# EAGLE design pi backback (EAGLE 6.4)
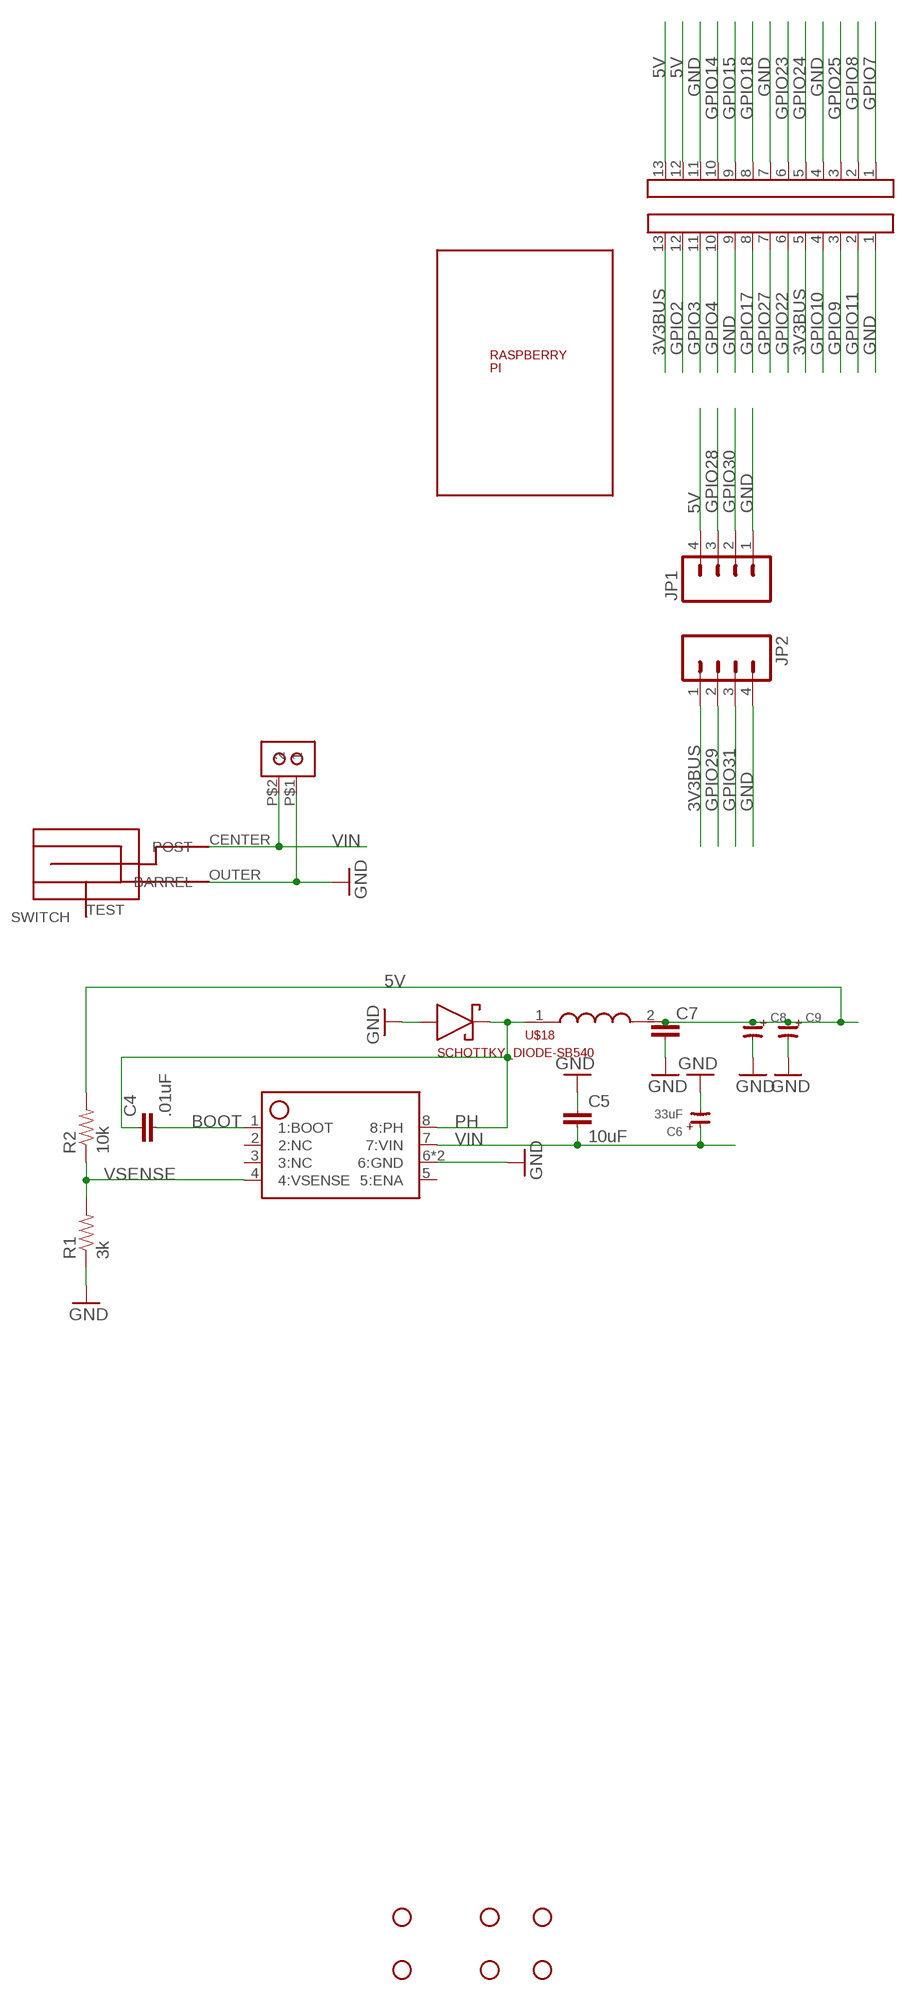
[diagram p0: schematic, sheet 1, part 1 of 2]
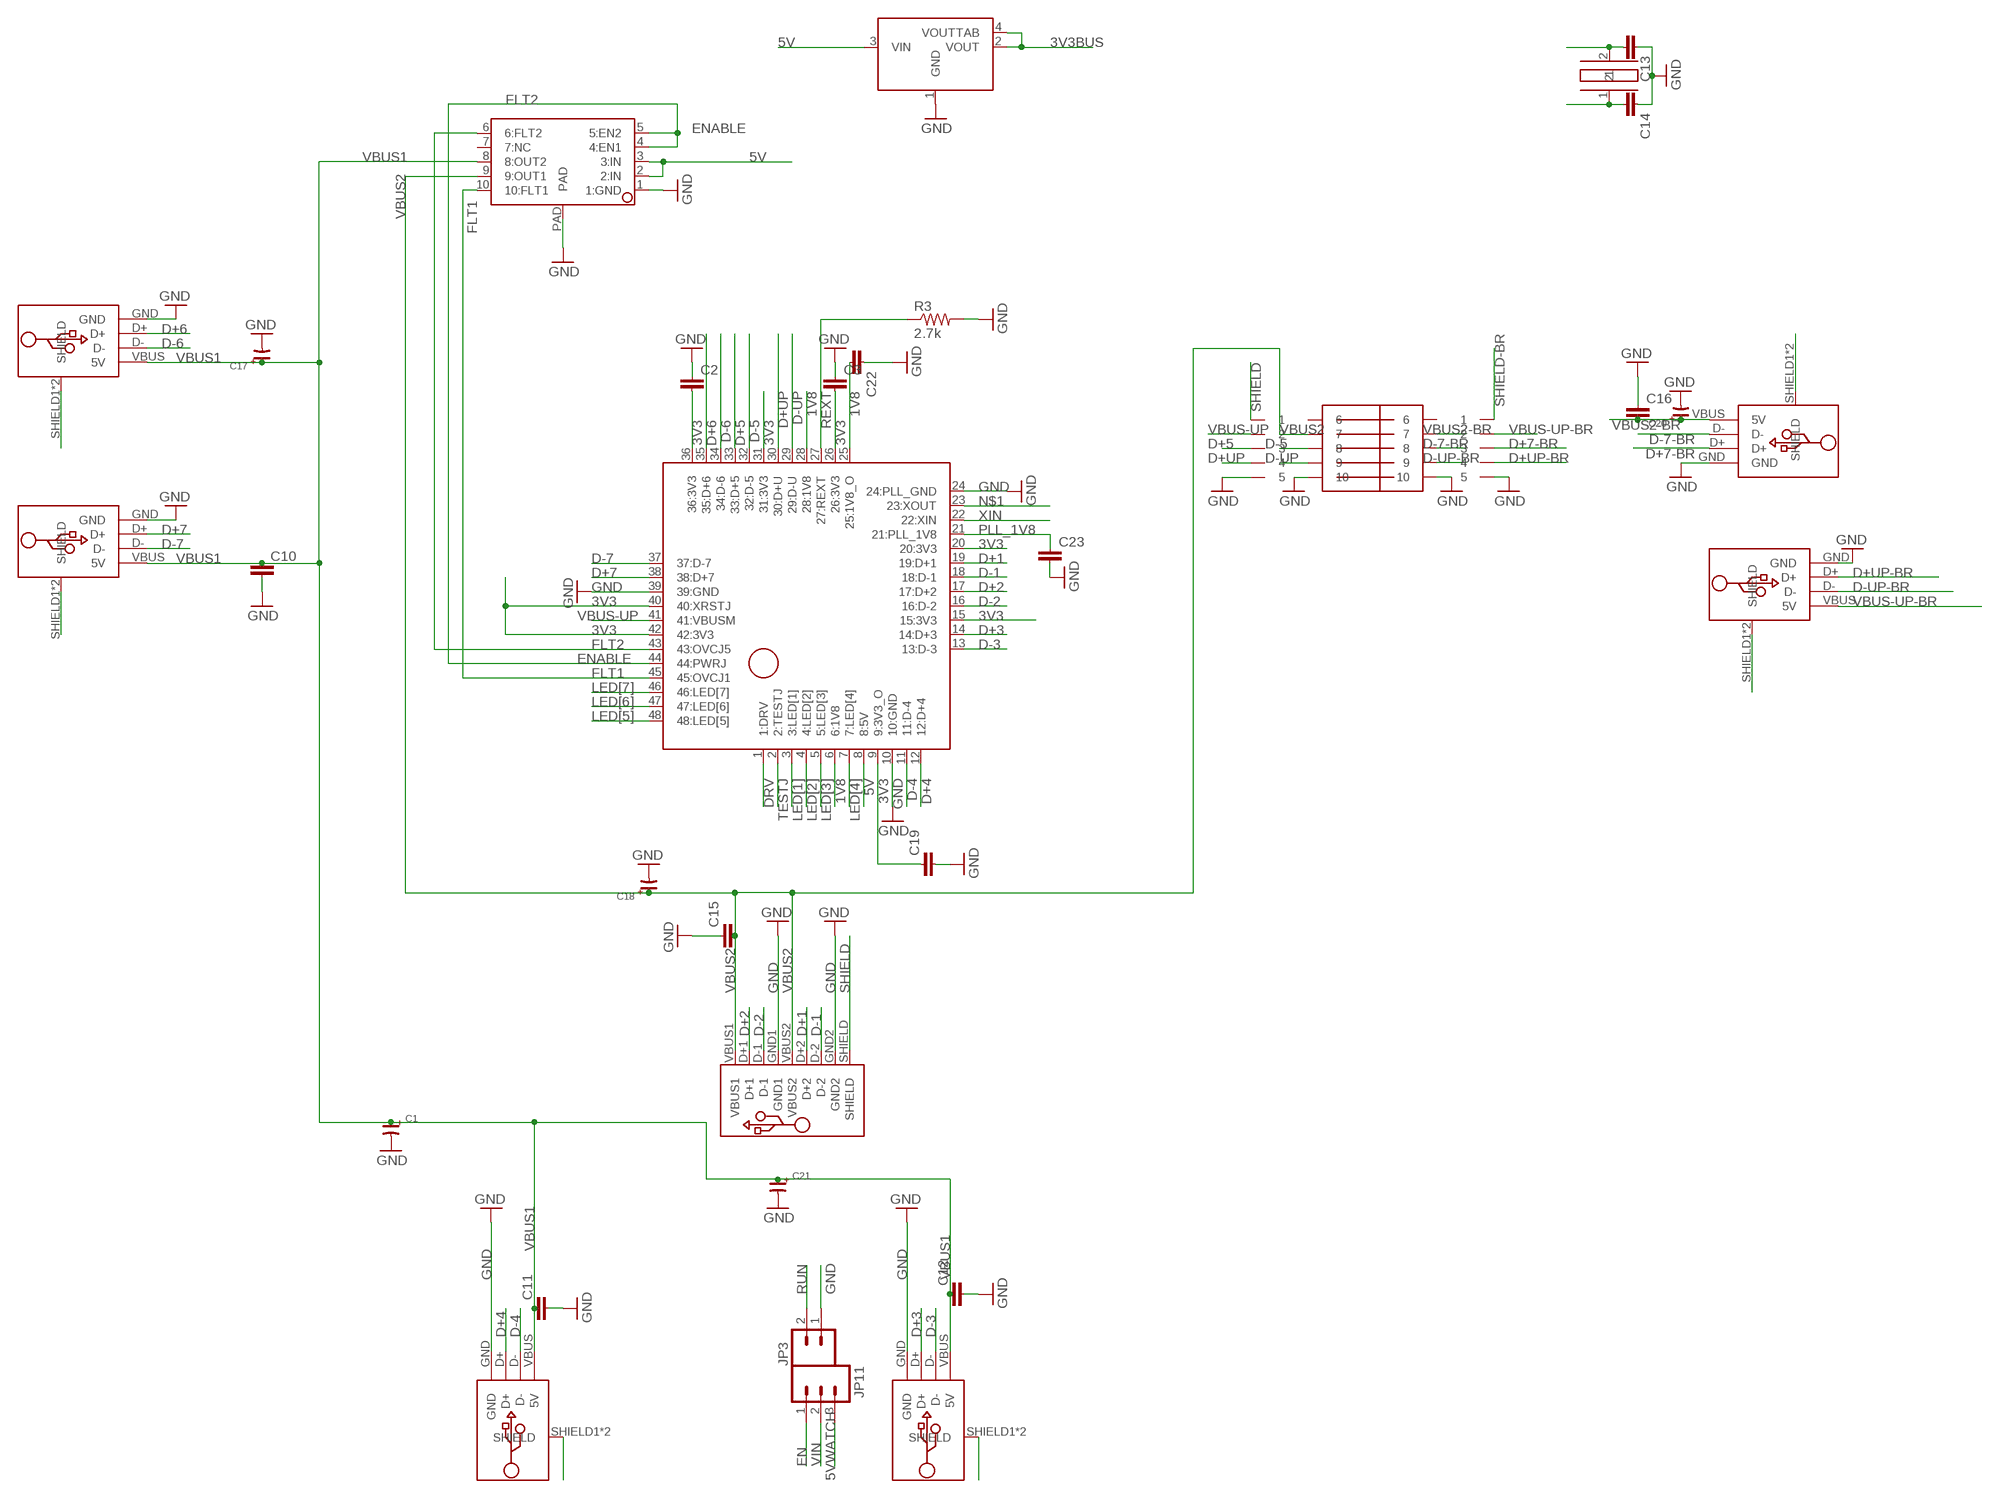
[diagram p1: schematic, sheet 1, part 2 of 2]

## Parts
C1  CAPPOL-5X11  [5X11MMCAP]
C2  CAP0805  [0805]
C3  CAP0805  [0805]
C4  .01uF  CAP0603-CAP  [0603-CAP]
C5  10uF  CAP1206  [1206]
C6  33uF  CAPPOL-8X11  [8MMCAP]
C7  CAP1206  [1206]
C8  CAPPOL-XX6.3  [6.3MMDIAMELECTROLYTIC]
C9  CAPPOL-XX6.3  [6.3MMDIAMELECTROLYTIC]
C10  CAP0805  [0805]
C11  CAP0805  [0805]
C12  CAP0805  [0805]
C13  CAP0603-CAP  [0603-CAP]
C14  CAP0603-CAP  [0603-CAP]
C15  CAP0805  [0805]
C16  CAP0805  [0805]
C17  CAPPOL-5X11  [5X11MMCAP]
C18  CAPPOL-5X11  [5X11MMCAP]
C19  CAP1206  [1206]
C20  CAPPOL-5X11  [5X11MMCAP]
C21  CAPPOL-5X11  [5X11MMCAP]
C22  CAP1206  [1206]
C23  CAP0805  [0805]
JP1  M04LOCK  [1X04_LOCK]
JP2  M04LOCK  [1X04_LOCK]
JP3  M02LOCK  [1X02_LOCK]
JP4  STAND-OFFTIGHT  [STAND-OFF-TIGHT]
JP5  STAND-OFFTIGHT  [STAND-OFF-TIGHT]
JP6  STAND-OFFTIGHT  [STAND-OFF-TIGHT]
JP7  STAND-OFFTIGHT  [STAND-OFF-TIGHT]
JP9  STAND-OFFTIGHT  [STAND-OFF-TIGHT]
JP10  STAND-OFFTIGHT  [STAND-OFF-TIGHT]
JP11  M03LOCK  [1X03_LOCK]
R1  3k  RESISTOR  [0805]
R2  10k  RESISTOR  [0805]
R3  2.7k  RESISTOR  [0805]
U$1  RASPBERRY-PI-OUTLINE  [RASPBERRY-PI-REV2-OUTLINE]
U$2  M13  [1X13_LOCK]
U$3  M13  [1X13_LOCK]
U$4  TPS200(2/3)C  [SON-10]
U$5  FE2.1-48  [LQFP-48]
U$6  USB-A-MALE  [USB-A-MALE]
U$7  SCREWTERM-2MA212-2  [MA212-2]
U$8  USB-A-FEMALE  [USB-A-FEMALE]
U$9  USB-A-FEMALE  [USB-A-FEMALE]
U$10  USB-A-FEMALE  [USB-A-FEMALE]
U$11  USB_HEADER  [USB_HEADER]
U$12  USB-A-FEMALE  [USB-A-FEMALE]
U$13  TPS5450  [SOIC8-POWERPAD]
U$14  M05X02_FEM-LOCK_RIGHT_ANGLE_FEM  [2X05_LOCK_RIGHT_ANGLE_FEM]
U$15  M05X02_MALE  [2X05_LOCK_RIGHT_ANGLE_MALE]
U$16  USB-A-FEMALE  [USB-A-FEMALE]
U$17  POWER-JACK-2.1MM  [2.1MM-POWER-JACK]
U$18  INDUCTOR-DR13-RT-A  [DR13-RT-A]
U$19  SCHOTTKY_DIODE-SB540  [DO-201-AD]
U$20  CRYSTAL-HC49  [HC49US]
U$21  3V3-LDO-ZLDO1117  [ZLDO1117]

## Nets
1V8: C22.2 U$5.6(6:1V8) U$5.25(25:1V8_O) U$5.28(28:1V8)
3V3: C2.2 C3.2 C19.1 U$5.9(9:3V3_O) U$5.15(15:3V3) U$5.20(20:3V3) U$5.26(26:3V3) U$5.31(31:3V3) U$5.36(36:3V3) U$5.40(40:XRSTJ) U$5.42(42:3V3)
3V3BUS: JP2.1 U$2.5 U$2.13 U$21.2(VOUT) U$21.4(VOUTTAB)
5V: C7.1 C8.+ C9.+ JP1.4 R2.2 U$3.12 U$3.13 U$4.2(2:IN) U$4.3(3:IN) U$5.8(8:5V) U$18.2 U$21.3(VIN)
5VWATCH: JP11.3
BOOT: C4.2 U$13.1(1:BOOT)
D+1: U$5.19(19:D+1) U$11.D+2
D+2: U$5.17(17:D+2) U$11.D+1
D+3: U$5.14(14:D+3) U$12.D+
D+4: U$5.12(12:D+4) U$16.D+
D+5: U$5.33(33:D+5) U$14.3
D+6: U$5.35(35:D+6) U$9.D+
D+7: U$5.38(38:D+7) U$8.D+
D+7-BR: U$10.D+ U$15.3
D+UP: U$5.30(30:D+U) U$14.4
D+UP-BR: U$6.D+ U$15.4
D-1: U$5.18(18:D-1) U$11.D-2
D-2: U$5.16(16:D-2) U$11.D-1
D-3: U$5.13(13:D-3) U$12.D-
D-4: U$5.11(11:D-4) U$16.D-
D-5: U$5.32(32:D-5) U$14.8
D-6: U$5.34(34:D-6) U$9.D-
D-7: U$5.37(37:D-7) U$8.D-
D-7-BR: U$10.D- U$15.8
D-UP: U$5.29(29:D-U) U$14.9
D-UP-BR: U$6.D- U$15.9
DRV: U$5.1(1:DRV)
EN: JP11.1
ENABLE: U$4.4(4:EN1) U$4.5(5:EN2) U$5.44(44:PWRJ)
FLT1: U$4.10(10:FLT1) U$5.45(45:OVCJ1)
FLT2: U$4.6(6:FLT2) U$5.43(43:OVCJ5)
GND: C1.- C2.1 C3.1 C5.1 C6.- C7.2 C8.- C9.- C10.2 C11.2 C12.2 C13.1 C14.1 C15.1 C16.1 C17.- C18.- C19.2 C20.- C21.- C22.1 C23.2 JP1.1 JP2.4 JP3.1 R1.1 R3.2 U$2.1 U$2.9 U$3.4 U$3.7 U$3.11 U$4.1(1:GND) U$4.PAD U$5.10(10:GND) U$5.24(24:PLL_GND) U$5.39(39:GND) U$6.GND U$7.P$1 U$8.GND U$9.GND U$10.GND U$11.GND1 U$11.GND2 U$12.GND U$13.6(6:GND) U$13.PAD(6:GND) U$14.5 U$14.10 U$15.5 U$15.10 U$16.GND U$17.OUTER(BARREL) U$19.A(ANODE) U$21.1(GND)
GPIO2: U$2.12
GPIO3: U$2.11
GPIO4: U$2.10
GPIO7: U$3.1
GPIO8: U$3.2
GPIO9: U$2.3
GPIO10: U$2.4
GPIO11: U$2.2
GPIO14: U$3.10
GPIO15: U$3.9
GPIO17: U$2.8
GPIO18: U$3.8
GPIO22: U$2.6
GPIO23: U$3.6
GPIO24: U$3.5
GPIO25: U$3.3
GPIO27: U$2.7
GPIO28: JP1.3
GPIO29: JP2.2
GPIO30: JP1.2
GPIO31: JP2.3
LED[1]: U$5.3(3:LED[1])
LED[2]: U$5.4(4:LED[2])
LED[3]: U$5.5(5:LED[3])
LED[4]: U$5.7(7:LED[4])
LED[5]: U$5.48(48:LED[5])
LED[6]: U$5.47(47:LED[6])
LED[7]: U$5.46(46:LED[7])
N$1: U$5.23(23:XOUT)
N$2: C14.2 U$20.1
PH: C4.1 U$13.8(8:PH) U$18.1 U$19.C(CATHODE)
PLL_1V8: C23.1 U$5.21(21:PLL_1V8)
REXT: R3.1 U$5.27(27:REXT)
RUN: JP3.2
SHIELD: U$8.SHIELD1(SHIELD) U$8.SHIELD2(SHIELD) U$9.SHIELD1(SHIELD) U$9.SHIELD2(SHIELD) U$11.SHIELD U$12.SHIELD1(SHIELD) U$12.SHIELD2(SHIELD) U$14.1 U$16.SHIELD1(SHIELD) U$16.SHIELD2(SHIELD)
SHIELD-BR: U$6.SHIELD1(SHIELD) U$6.SHIELD2(SHIELD) U$10.SHIELD1(SHIELD) U$10.SHIELD2(SHIELD) U$15.1
TESTJ: U$5.2(2:TESTJ)
VBUS1: C1.+ C10.1 C11.1 C12.1 C17.+ C21.+ U$4.8(8:OUT2) U$8.VBUS(5V) U$9.VBUS(5V) U$12.VBUS(5V) U$16.VBUS(5V)
VBUS2: C15.2 C18.+ U$4.9(9:OUT1) U$11.VBUS1 U$11.VBUS2 U$14.7
VBUS2-BR: C16.2 C20.+ U$10.VBUS(5V) U$15.7
VBUS-UP: U$5.41(41:VBUSM) U$14.2
VBUS-UP-BR: U$6.VBUS(5V) U$15.2
VIN: C5.2 C6.+ JP11.2 U$7.P$2 U$13.7(7:VIN) U$17.CENTER(POST)
VSENSE: R1.2 R2.1 U$13.4(4:VSENSE)
XIN: U$5.22(22:XIN)
XOUT: C13.2 U$20.2
Unconnected: U$4.7(7:NC) U$13.2(2:NC) U$13.3(3:NC) U$13.5(5:ENA) U$14.6 U$15.6 U$17.TEST(SWITCH)

## Library data of the parts
C1 C6 C8 C9 C17 C18 C20 C21 = 1dah:CAPPOL: Electrolytic capacitor
C2-C5 C7 C10-C16 C19 C22 C23 = 1dah:CAP: Capacitor Standard 0402 ceramic capacitor, and 0.1" leaded capacitor.
JP1 JP2 = 1dah:M04: Header 4 Standard 4-pin 0.1" header. Use with straight break away headers (SKU : PRT-00116), right angle break away headers (PRT-00553), swiss pins (PRT-00743), machine pins (PRT-00117), and female headers (PRT-00115). Molex polarized connector foot print use with SKU : PRT-08231 with associated crimp pins and housings.
JP3 = 1dah:M02: Header 2 Standard 2-pin 0.1" header. Use with straight break away headers (SKU : PRT-00116), right angle break away headers (PRT-00553), swiss pins (PRT-00743), machine pins (PRT-00117), and female headers (PRT-00115). Molex polarized connector foot print use with SKU : PRT-08233 with associated crimp pins and housings.
JP4-JP7 JP9 JP10 = 1dah:STAND-OFF: Stand Off This is the mechanical footprint for a #4 phillips button head screw. Use the keepout ring to avoid running the screw head into surrounding components. SKU : PRT-00447
JP11 = 1dah:M03: Header 3 Standard 3-pin 0.1" header. Use with straight break away headers (SKU : PRT-00116), right angle break away headers (PRT-00553), swiss pins (PRT-00743), machine pins (PRT-00117), and female headers (PRT-00115). Molex polarized connector foot print use with SKU : PRT-08232 with associated crimp pins and housings.
R1-R3 = 1dah:RESISTOR: Resistor Basic schematic elements and footprints for 0603, 1206, and PTH 1/10th watt (small) resistors.
U$1 = RaspberryPi:RASPBERRY-PI-OUTLINE
U$2 U$3 = 1dah:M13
U$4 = 1dah:TPS200(2/3)C: TPS2002C/TPS2003C 2-ch 2A current limited switch. 2002C - logic low enable 2003C - logic high enable
U$5 = 1dah:FE2.1-48: FE2.1 USB 2.0 7-port hub chip in TQFP-48 pkg. Gangs power control monitoring into ports 1-4 and 5-7 on OVCJ1 and 5 respectively. PWRJ controls all downstream ports. Lower power consumption than SCMC chips and lower cost.
U$6 U$8-U$10 U$12 U$16 = 1dah:USB: USB male plug directly on PCB
U$7 = 1dah:SCREWTERM-2
U$11 = 1dah:USB_HEADER
U$13 = 1dah:TPS5450: 5A buck converter 6A peak 5.5-36V input
U$14 = 1dah:M05X02_FEM
U$15 = 1dah:M05X02_MALE
U$17 = 1dah:POWER-JACK
U$18 = 1dah:INDUCTOR
U$19 = 1dah:SCHOTTKY_DIODE: 45V, 1.5A schottky diode
U$20 = 1dah:CRYSTAL
U$21 = 1dah:3V3-LDO

## Board
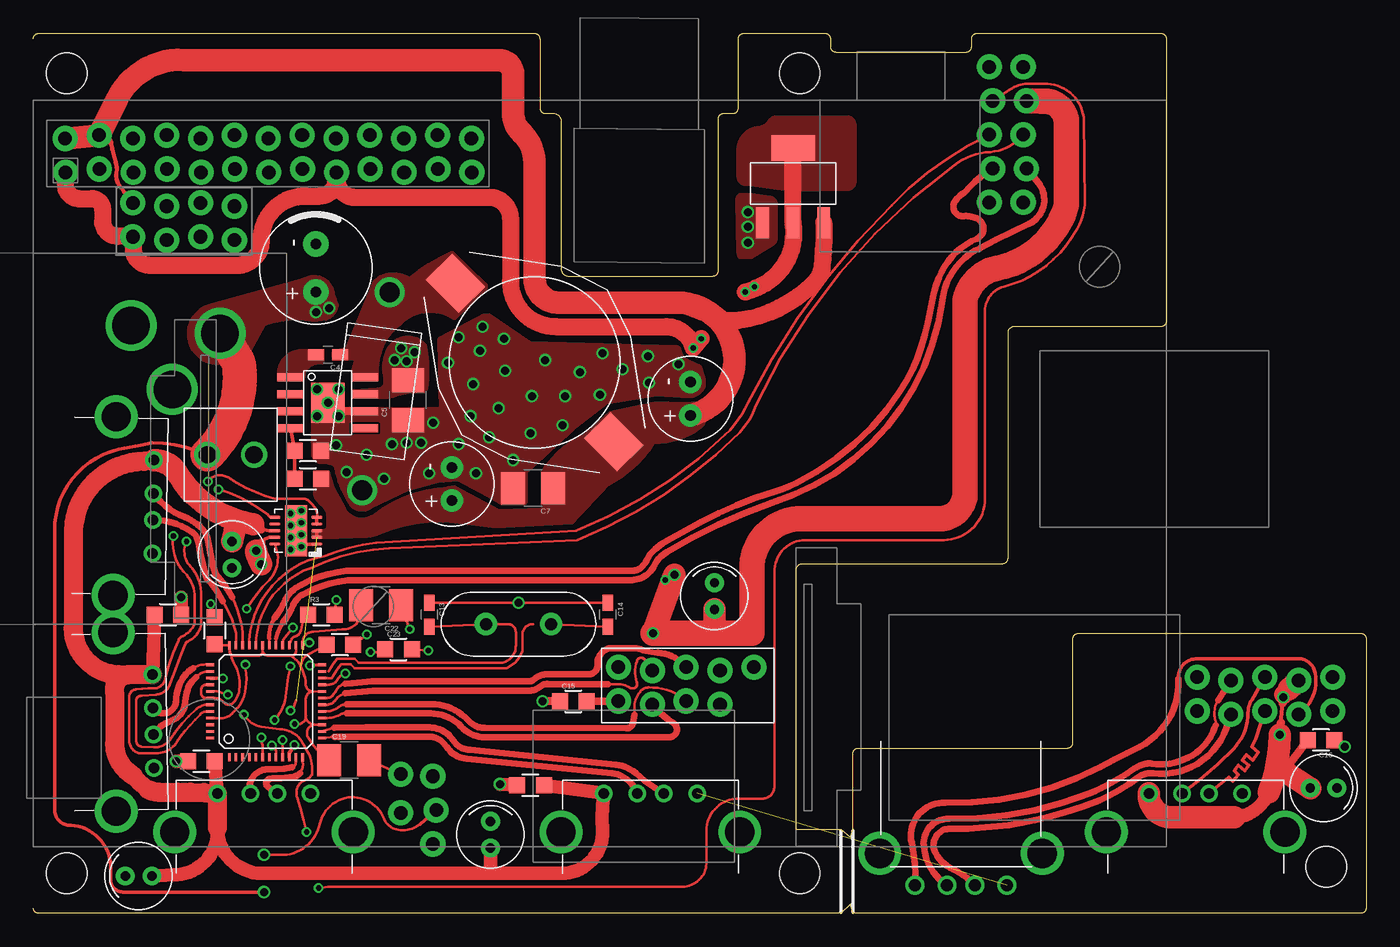
[diagram p2: board, top side]
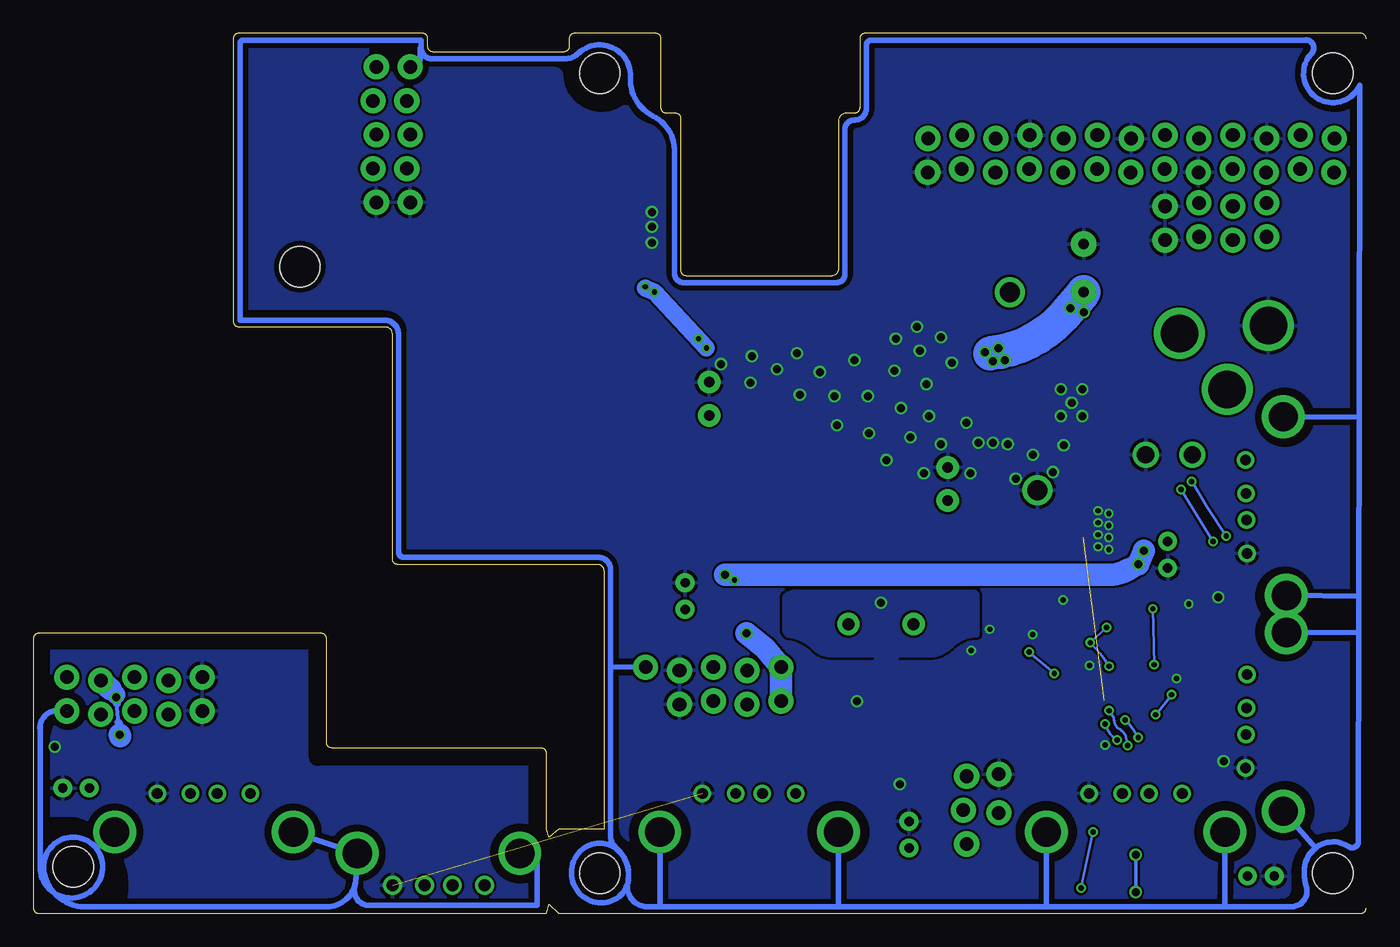
[diagram p3: board, bottom side, seen from below]

Size 100 x 66 mm. Coordinates in mm from the lower left corner, seen from the top.
Outline: 0,0.4 arc90 0.4,0 60.6,0 61.3,0.7 61.5,0 99.6,0 arc90 100,0.4 100,20.6 arc90 99.6,21 78.4,21 arc90 78,20.6 78,12.8 arc-90 77.6,12.4 61.9,12.4 arc90 61.5,12 61.5,6.3 61.3,5.7 60.6,6.3 57.2,6.3 57.2,25.7 arc-90 57.7,26.2 72.7,26.2 arc90 73.1,26.6 73.1,43.5 arc-90 73.6,44 84.6,44 arc90 85,44.4 85,65.6 arc90 84.6,66 70.8,66 arc90 70.4,65.6 70.4,65 arc-90 70,64.6 60.2,64.6 arc-90 59.8,65 59.8,65.6 arc90 59.4,66 53.3,66 arc90 52.9,65.6 52.9,60.4 arc-90 52.5,60 51.8,60 arc90 51.4,59.6 51.4,48.2 arc-90 51,47.8 40.1,47.8 arc-90 39.6,48.4 39.6,59.4 arc90 39,60 38.4,60 arc-90 38,60.4 38,65.6 arc90 37.6,66 0.41,66 arc90 0,65.59
Copper layers (1*16): Top 0.035mm / dielectric 1.5mm / Bottom 0.035mm
Design rules "Fusion_eagle_rule_v1.1(mod)": minimum track width 7mil, minimum drill 12mil, track to track 7mil, track to pad 7mil, pad to pad 7mil, via to via 7mil, smd to smd 0mil, copper to edge 10mil, drill to drill 10mil, minimum pad ring 10mil, minimum via ring 6mil, stop-mask expansion 2mil, vias tented up to drill 100mil, thermal gap 10mil
bRestrict: area 61.4,2.4 to 65.6,6.6; area 73.7,2.5 to 77.7,6.5; area 78.5,4.1 to 82.5,8.1; area 91.9,4.1 to 95.9,8.1; area 96.2,14 to 98.6,16.4; area 8.5,4 to 12.7,8.2; area 21.9,4 to 26.1,8.2; area 37.5,4 to 41.7,8.2; area 50.9,4 to 55.1,8.2; area 71,62.8 to 72.4,64.2; area 4.1,5.7 to 8.1,9.7; area 4.1,19.1 to 8.1,23.1; 2 more areas; 93 lines

### Footprints (pad centres in the part's own frame; a part is rotated, then mirrored left to right if it is on the bottom)
5X11MMCAP = drill 0.7 pad 1.422: + 0,-1; - 0,1
0805 = smd 1.2 x 1.2: 1 -1,0; 2 1,0
0603-CAP = smd 1.2 x 0.8: 1 -0.9,0; 2 0.9,0
1206 = smd 1.8 x 2.4: 1 -1.5,0; 2 1.5,0
8MMCAP = drill 0.8 pad 1.93: + 1.8,0; - -1.8,0
6.3MMDIAMELECTROLYTIC = drill 0.8 pad 1.676: + -1.25,0; - 1.25,0
1X04_LOCK = drill 1.016 pad 1.88: 1 0,0.127; 2 2.54,-0.127; 3 5.08,0.127; 4 7.62,-0.127
1X02_LOCK = drill 1.016 pad 1.88: 1 -0.178,0; 2 2.718,0
STAND-OFF-TIGHT = hole 3.048: 0,0
1X03_LOCK = drill 1.016 pad 1.88: 1 0,0.127; 2 2.54,-0.127; 3 5.08,0.127
1X13_LOCK = drill 1.016 pad 1.88: 1 0,0.127; 2 2.54,-0.127; 3 5.08,0.127; 4 7.62,-0.127; 5 10.16,0.127; 6 12.7,-0.127; 7 15.24,0.127; 8 17.78,-0.127; 9 20.32,0.127; 10 22.86,-0.127; 11 25.4,0.127; 12 27.94,-0.127; 13 30.48,0.127
SON-10 = smd 0.25 x 0.84: 1 -1,-1.57; 2 -0.5,-1.57; 3 0,-1.57; 4 0.5,-1.57; 5 1,-1.57; 6 1,1.57; 7 0.5,1.57; 8 0,1.57; 9 -0.5,1.57; 10 -1,1.57 | smd 3.8 x 1.65: PAD 0,0
LQFP-48 = smd 0.6 x 0.2: 1 -4.2,2.75; 2 -4.2,2.25; 3 -4.2,1.75; 4 -4.2,1.25; 5 -4.2,0.75; 6 -4.2,0.25; 7 -4.2,-0.25; 8 -4.2,-0.75; 9 -4.2,-1.25; 10 -4.2,-1.75; 11 -4.2,-2.25; 12 -4.2,-2.75; 25 4.2,-2.75; 26 4.2,-2.25; 27 4.2,-1.75; 28 4.2,-1.25; 29 4.2,-0.75; 30 4.2,-0.25; 31 4.2,0.25; 32 4.2,0.75; 33 4.2,1.25; 34 4.2,1.75; 35 4.2,2.25; 36 4.2,2.75 | smd 0.2 x 0.6: 13 -2.75,-4.2; 14 -2.25,-4.2; 15 -1.75,-4.2; 16 -1.25,-4.2; 17 -0.75,-4.2; 18 -0.25,-4.2; 19 0.25,-4.2; 20 0.75,-4.2; 21 1.25,-4.2; 22 1.75,-4.2; 23 2.25,-4.2; 24 2.75,-4.2; 37 2.75,4.2; 38 2.25,4.2; 39 1.75,4.2; 40 1.25,4.2; 41 0.75,4.2; 42 0.25,4.2; 43 -0.25,4.2; 44 -0.75,4.2; 45 -1.25,4.2; 46 -1.75,4.2; 47 -2.25,4.2; 48 -2.75,4.2
USB-A-MALE = drill 0.9: D+ -1.05,10.8; D- 1.04,10.8; GND -3.45,10.8; VBUS 3.45,10.8 | drill 2.2: SHIELD1 -6.1,8.4; SHIELD2 6.1,8.4
MA212-2 = drill 1.3: P$1 -1.75,0; P$2 1.75,0
USB-A-FEMALE = drill 0.8: D+ 1,6; D- -1,6; GND 3.5,6; VBUS -3.5,6 | drill 2.2: SHIELD1 -6.7,3.1; SHIELD2 6.7,3.1
USB_HEADER = drill 1.016 pad 1.88: D+1 5.08,0.127; D+2 5.08,2.667; D-1 2.54,-0.127; D-2 2.54,2.413; GND1 7.62,-0.127; GND2 7.62,2.413; SHIELD 10.16,2.667; VBUS1 0,0.127; VBUS2 0,2.667
SOIC8-POWERPAD = smd 2 x 0.6: 1 -2.8,1.92; 2 -2.8,0.64; 3 -2.8,-0.64; 4 -2.8,-1.92; 5 2.78,-1.92; 6 2.78,-0.64; 7 2.78,0.64; 8 2.78,1.92 | smd 2.5 x 3: PAD 0,0
2X05_LOCK_RIGHT_ANGLE_FEM = drill 1.016 pad 1.88: 1 -6.477,5.08; 2 -6.223,2.54; 3 -6.477,0; 4 -6.223,-2.54; 5 -6.477,-5.08; 6 -3.937,5.08; 7 -3.683,2.54; 8 -3.937,0; 9 -3.683,-2.54; 10 -3.937,-5.08
2X05_LOCK_RIGHT_ANGLE_MALE = drill 1.016 pad 1.88: 1 6.223,5.08; 2 6.477,2.54; 3 6.223,0; 4 6.477,-2.54; 5 6.223,-5.08; 6 3.683,5.08; 7 3.937,2.54; 8 3.683,0; 9 3.937,-2.54; 10 3.683,-5.08
2.1MM-POWER-JACK = drill 2.8: CENTER 0,0; OUTER 6.7,0; TEST 3.2,4.5
DR13-RT-A = smd 2.79 x 3.5: 1 0,8.4; 2 0,-8.4
DO-201-AD = drill 1.5: A 7.5,0; C -7.5,0
HC49US = drill 0.9 pad 1.676: 1 -2.44,0; 2 2.44,0
ZLDO1117 = smd 0.95 x 2.3: 1 -2.3,-3; 2 0,-3; 3 2.3,-3 | smd 3.25 x 1.9: 4 0,2.6

### Placement (x,y rotation side)
C1  34.3,5.9 0 top
C2  23,20.15 180 top
C3  13.6,21.2 270 top
C4  22.1,41.9 180 top
C5  28.1,38.5 90 top
C6  21.2,48.4 270 top
C7  37.5,31.9 180 top
C8  49.3,38.6 90 top
C9  31.4,32.2 90 top
C10  10.1,22.4 0 top
C11  12.6,11.4 180 top
C12  37.3,9.6 180 top
C13  29.7,22.4 270 top
C14  43.1,22.4 270 top
C15  40.5,15.9 0 top
C16  96.6,13 180 top
C17  14.9,26.9 180 top
C18  51.1,23.8 0 top
C19  23.7,11.5 0 top
C20  96.8,9.4 270 top
C21  7.9,2.8 90 top
C22  26.1,23.1 180 top
C23  27.4,19.8 0 top
JP1  15.09,53.16 180 top
JP2  7.47,50.62 0 top
JP3  27.56,10.26 270 top
JP4  2.5,2.99 0 top
JP5  57.5,3 0 top
JP6  2.5,63 0 top
JP7  80,48.5 0 top
JP9  97,3.5 0 top
JP10  57.5,63 0 top
JP11  30.1,5.2 90 top
R1  20.6,34.7 180 top
R2  20.6,32.6 0 top
R3  21.6,22.4 0 top
U$1  0,5 0 top
U$2  32.9,55.7 180 top
U$3  32.87,58.24 180 top
U$4  19.7,28.7 90 top
U$5  17.45,15.89 90 top
U$6  69.6,12.9 180 top
U$7  14.8,34.4 180 top
U$8  3,14.3 271 top
U$9  3,30.6 269 top
U$10  87.2,3 0 top
U$11  43.9,15.8 0 top
U$12  46.3,3 0 top
U$13  22.1,38.3 0 top
U$14  78.2,58.4 0 top
U$15  92.4,21.4 270 top
U$16  17.3,3 0 top
U$17  14.01,43.5 175 top
U$18  37.6,41.32 45 top
U$19  25.7,39.15 262 top
U$20  36.4,21.7 180 top
U$21  57,54.8 0 top

### Tracks (layer width: path | path; a pad name or v marks a point on that pad's centre or on a via)
1V8  (via drill 0.4)
  Top 0.2: C22.2 arc-106 23.2,21.3 21,21.11 arc91 20.2,20.31 U$5.25 v20.7,20.3 | v19.48,21.44 18.73,20.51 U$5.28 | U$5.6 17.2,12.6 arc-23 v17.1,13.2 | v18.1,14.5 arc28 18.9,16 arc-8 v19.29,18.53
  Bottom 0.2: v19.48,21.44 v20.7,20.3 arc15 v19.29,18.53 | v17.1,13.2 arc-18 v18.1,14.5
3V3  (via drill 0.4)
  Top 0.2: C3.2 13.8,20.1 U$5.36 | U$5.26 19.71,19.67 arc-101 19.31,19.32 | 19.31,19.32 17.61,19.32 arc-69 17.24,19.58 | 17.24,19.58 arc-32 U$5.31 | U$5.36 arc4 14.71,19.68 arc83 15.07,19.32 16.8,19.32 arc61 17.24,19.58 | U$5.20 21.01,16.64 | 21.01,16.64 arc-92 20.44,17.2 arc27 20.07,18.5 | 20.07,18.5 arc38 19.31,19.32 | U$5.15 21.08,14.16 | 21.08,14.16 arc-98 20.44,14.94 | 20.44,14.94 20.44,16.07 arc-90 21.01,16.64 | 21.08,14.16 arc104 20.58,13.24 arc28 C19.1 | C2.2 20.59,19.39 arc57 20.07,18.5 | U$5.36 arc30 15.3,18.3 arc-22 15.46,16.75 arc-27 15.1,15.9 arc-113 14.2,15.9 arc39 13.78,16.14 U$5.42 12.96,16.14 arc-92 12.6,16.5 arc-2 12.6,16.8 arc-88 12.94,17.14 U$5.40 | U$5.9 18.7,12.1 arc-1 v18.7,13 | v19.6,14.2 20,14.2 arc83 20.44,14.94
  Bottom 0.2: v18.7,13 arc35 v19.6,14.2
3V3BUS  (via drill 0.4)
  Top 0.2: v54.1,47 54.2,46.9
  Top 1.27: U$21.4 U$21.2 arc-79 54.2,46.9 v53.4,46.6 | U$2.13 2.4,54.7 arc87 3.4,53.6 4.4,53.6 arc-90 5.2,52.8 5.2,51.9 arc95 6.4,50.8 arc-16 JP2.1 7.5,49.8 arc86 8.7,48.6 15.4,48.6 arc90 17.1,50.5 arc-92 20.5,53.8 21.5,53.8 arc85 22.7,54.9 arc3 U$2.5 22.8,54.9 arc84 24.1,53.7 34.2,53.7 arc-86 35.8,52.2 35.8,47.4 arc90 39.2,44 47.5,44 arc-77 v49.5,42.4 v50.1,43.1
  Bottom 1.27: v49.5,42.4 v53.4,46.6 54.1,46.9
  pour Top (no thermals): 57,54.7 53.4,55.2 53.4,57.3 arc-85 54.4,58.4 arc52 55.7,59.2 61.1,59.2 61.1,54.8
5V  (via drill 0.4)  (1 unrouted)
  Top 0.2: U$5.8 18.2,12.1 arc73 v17.9,12.6 | v19.3,15.2 arc42 19.7,16
  Top 0.254: U$4.3 U$4.2
  Top 0.305: 5.8,57.8 arc5 6.18,56.32 arc-12 6.24,55.94 6.21,55.39 arc37 6.5,54.5 arc3 JP1.4
  Top 0.406: U$3.12 arc-81 5.8,57.8
  Top 1.27: U$21.3 59.3,50.2 arc-8 59.2,48.5 arc-38 58.6,47.3 arc-31 53.7,44.6 arc-21 51.7,44.5 48.3,45.8
  Top 1.676: U$3.13 U$3.12 6.3,61.1 arc-66 11.3,64 34.9,64 arc-90 36,62.9 36,60 arc46 36.6,58.6 arc-49 37.6,56.1 37.6,47.6 arc93 39.5,45.8 48.3,45.8 arc-167 C8.+
  Bottom 0.2: v17.9,12.6 18,13.1 arc-52 18.5,13.8 arc56 18.9,14.4 arc-42 v19.3,15.2
  pour Top (no thermals): 41.32,35.83 43.25,37.56 46.8,38.3 arc10 49.4,38.27 arc-133 50.1,36.5 arc-38 46.5,35.3 arc-35 43.1,32.2 40.4,29.3 34.7,29 31.3,29.4 arc-56 30.3,30.6 arc-105 31.59,31.95 34.9,30.2 38.2,30.3 38.2,33.1 arc-36
  pour Top (no thermals): 21,28.2 21,28.7 21.8,28.7 arc90 22.1,29 22.1,29.8 arc37 21.9,30.4 arc16 21.6,30.7 arc-57 21.1,31.8 21.1,33.1 22.1,33.1 22.5,31.9 23.3,30.4 arc98 25.5,29.8 arc-34 31.2,31.9 arc-182 31.5,29.4 arc27 25.9,28.5 arc-27 25,28.3 arc-4 21.8,28.2
BOOT
  pour Top (no thermals): 21.7,42.2 20.1,42.2 arc90 18.4,40.5 18.4,40 20.2,40 20.3,40.4 arc-78 21.5,41.3 21.7,41.3
D+1
  Top 0.2: U$5.19 22.04,16.15 arc44 22.4,16.3 arc17 22.7,16.7 arc-51 23.4,17.21
  Top 0.406: 45.76,19.74 arc19 46.86,19.55
  Top 0.5: 23.4,17.21 23.91,17.26 25.4,17.4 37.22,17.4 arc51 37.58,17.57 arc-24 37.68,17.65 arc6 37.82,17.73 arc-34 38.5,17.92 41.69,17.93 arc93 42.32,18.6 arc-81 43.3,19.9 44.9,19.9 arc-21 45.76,19.74 | 46.86,19.55 arc-45 U$11.D+2
D+2
  Top 0.2: U$5.17 22.07,15.15 arc36 22.8,15.4 arc-37 23.5,15.68 | U$11.D+1 arc43 46.16,16.94 arc51 45.5,16.6 arc38 45.1,15.4 arc-18 45.1,14.9
  Top 0.5: 23.5,15.68 29.85,15.68 arc-44 32.38,14.7 arc-4 32.73,14.37 arc50 33.87,13.91 44.5,13.88 arc80 45,14.3 arc1 45.1,14.9
D+3
  Top 0.2: U$5.14 22.58,13.92
  Top 0.5: 22.58,13.92 arc-1 29.72,13.94 arc-52 31.41,13.1 arc-2 31.6,12.84 arc35 32.18,12.39 arc15 32.77,12.26 43.71,11.15 arc-34 45.2,10.5 arc10 U$12.D+
D+4
  Top 0.2: U$5.12 20.2,11.4 arc-52 20,10.5
  Top 0.5: 20,10.5 arc-44 19.57,10.26 arc0 18.61,10.14 arc-10 18.37,10.13 arc11 17.76,10.09 arc136 17.61,9.48 arc15 U$16.D+
D+5
  Top 0.2: U$5.33 16.2,20.5 arc-74 21.8,26.8 arc-13 25.7,27.8 40.7,28.7 arc23 51.9,35.9 arc25 53.6,38.3 arc-18 64.4,53.1 arc-20 U$14.3
D+6
  Top 0.2: 15.21,20.45 U$5.35 15.2,21 arc22 14.2,23.4
  Top 0.5: 14.2,23.4 arc24 13.1,25 arc-30 12.9,25.5 arc-7 12.4,27.8 arc47 11.9,28.6 arc35 U$9.D+
D+7
  Top 0.2: 12.2,17.7 arc-51 U$5.38
  Top 0.5: 12.2,17.7 arc-7 12.15,17.65 arc30 11.57,16.77 arc15 11.4,15.91 arc-5 11.37,15.64 arc-28 11.12,15.04 arc-34 10.21,14.37 arc40 U$8.D+
D+7-BR
  Top 0.254: U$15.3 91.7,13.1 arc-16 91.4,12.5 91.9,12.1 91.5,11.5 91,11.9 90.7,11.5 91.2,11.1 90.9,10.7 90.4,11.1 90.1,10.7 90.4,10.4 90,9.9 89.7,10.2 U$10.D+
D+UP
  Top 0.2: U$5.30 17.7,20.6
  Top 0.305: 17.7,20.6 arc-33 18.11,22.16
  Top 0.5: U$14.4 arc18 69.89,54.1 arc17 69.19,53.46 arc136 69.83,52.29 arc-39 70.9,52.05 arc-125 70.79,50.6 arc45 67.93,47.66 arc11 67.5,46.19 arc-3 66.9,43.43 arc-20 65.03,39.14 arc-30 57.3,32.3 arc-10 55.6,31.63 arc12 50.06,29.32 47.55,27.94 47.15,27.72 46.63,27.32 46.28,26.94 46.07,26.6 arc-18 45.82,26.17 arc-14 45.54,25.9 arc-37 44.91,25.69 23.52,25.69 arc24 20.14,24.65 19.65,24.38 arc8 19.26,24.03 arc23 18.93,23.52 arc-13 18.11,22.16
D+UP-BR
  Top 0.5: U$15.4 89.5,13.9 arc-78 84,10.5 arc45 82.9,10.2 arc-15 80,8.5 arc-9 76.08,7.22 arc-3 73.2,6.6 70.13,6.36 68.77,6.35 arc119 67.7,4.5 arc36 69,3.3 arc-22 U$6.D+
D-1
  Top 0.2: U$5.18 22.03,15.65 arc46 22.6,15.9 arc-40 23.4,16.5 | 43.1,17.2 43.8,17.2 arc-33 44.8,16.9 arc141 45.27,17.35 arc-34 45.28,18.92 arc-139 45.91,18.97 arc3 U$11.D-2
  Top 0.5: 23.4,16.5 25.5,16.7 37.2,16.7 arc41 38,17 arc-45 38.6,17.2 43.1,17.2
D-2
  Top 0.2: U$5.16 22.06,14.65 arc28 23,14.9 arc-36 23.5,15
  Top 0.5: 23.5,15 29.8,15 arc-47 32.1,14 arc46 33.9,13.2 47.7,13.2 arc149 48,14.3 arc-22 U$11.D-1
D-3
  Top 0.2: U$5.13 22.57,13.24
  Top 0.5: 22.57,13.24 29.6,13.26 arc-57 31,12.5 arc52 32.5,11.6 43.4,10.5 arc-64 U$12.D-
D-4
  Top 0.2: U$5.11 19.7,11.4 arc-73 19.4,10.94
  Top 0.5: 19.4,10.94 arc-11 17.6,10.8 arc110 U$16.D-
D-5
  Top 0.2: U$14.8 arc-47 71.8,57.1 arc36 69.1,56.1 arc29 54.2,38.1 arc-26 53,36.1 arc-24 40.8,28 26.7,27.4 arc21 20.8,25.9 arc70 U$5.32
D-6
  Top 0.2: U$5.34 15.7,20.52 15.7,21.1 arc21 14.9,23.7
  Top 0.5: 14.9,23.7 arc16 13.67,25.42 13.46,26.14 13.08,28.05 arc31 12.7,28.8 arc27 11.33,29.73 arc-33 U$9.D-
D-7
  Top 0.2: 12,18.4 arc-41 U$5.37
  Top 0.5: 12,18.4 arc41 10.9,17 arc15 10.7,15.9 arc-142 U$8.D-
D-7-BR
  Top 0.254: U$15.8 91.4,16 arc30 91.13,15.03 arc-43 90.1,12.4 arc-11 U$10.D-
D-UP
  Top 0.2: 18.2,20.6 U$5.29
  Top 0.305: 18.2,20.6 arc-20 18.75,21.82
  Top 0.5: 18.75,21.82 arc16 19.5,23.1 arc-42 20.2,23.9 arc-20 23.6,25 44.9,25 arc64 46.6,26.1 arc-35 47.51,27.09 arc-12 55.4,30.79 arc66 68.2,46 arc-57 71,49.9 arc0 74.7,51.7 arc103 75.4,54.8 arc2 U$14.9
D-UP-BR
  Top 0.2: 88.9,16 arc30 88.61,15.13 arc21 88.7,14.4 arc-35 88.7,14.1
  Top 0.5: 88.9,16 U$15.9 | 88.7,14.1 arc-13 88.3,13.2 arc-33 86.7,11.7 arc-13 85.6,11.3 arc-22 83.91,11.23 arc22 83.44,11.21 arc17 82.58,10.86 81.94,10.38 80.61,9.64 arc-7 79.26,9 arc-23 68.7,7.1 arc95 66.8,5.1 arc52 U$6.D-
ENABLE  (via drill 0.4)
  Top 0.2: U$4.4 21.3,29.7 arc50 20.9,30.7 arc-4 20.7,30.9 arc41 20.3,31.1 18.1,31.1 arc-19 14.6,32.7 arc83 v13.09,32.39 | v10.5,28.3 arc56 11.5,25.4 arc-39 12.1,23.7 12.1,21.7 arc-41 11.2,20.8 arc41 10.9,20.5 arc11 9.9,17.6 arc-74 9.08,16.87 arc8 7.73,16.8 arc93 7.2,16.21 7.2,12.9 arc76 8,12 9.2,12 arc59 10.8,12.9 arc-11 11.4,13.7 arc0 12.5,14.9 arc-59 U$5.44
  Top 0.254: U$4.5 U$4.4
  Bottom 0.2: v10.5,28.3 11.9,30.4 v13.09,32.39
FLT1  (via drill 0.4)
  Top 0.2: U$5.45 14.25,14.65 arc51 15.1,15.2 arc33 15.8,16.3 arc12 16,17.6 v15.91,18.65 | U$4.10 18.3,27.1 arc-56 17.7,25 arc15 v16.01,22.84
  Bottom 0.2: v16.01,22.84 v15.91,18.65
FLT2  (via drill 0.4)
  Top 0.2: U$4.6 17.9,29.7 arc-67 17.6,29.9 arc22 v13.9,31.8 | v11.5,27.9 arc75 11.9,25.9 arc-42 12.6,23.8 12.6,21.8 arc-63 11.6,20.4 arc44 11.4,20.2 arc4 10.28,17.25 arc-66 9.2,16.4 8.12,16.33 arc90 7.7,15.9 7.7,13 arc77 8.1,12.5 9.05,12.46 arc59 10.3,13.1 arc-15 12.2,15.3 arc-47 U$5.43
  Bottom 0.2: v13.9,31.8 v11.5,27.9
GND  (via drill 0.4, 0.6)  (1 unrouted)
  Top 0.2: v13.3,23.19 C3.1 | C2.1 v25.04,20.91 | C13.1 v36.4,23.3 C14.1 | C19.2 JP3.1 | R3.2 v22.74,23.51 | C22.1 v28.24,21.31 | C23.2 v29.64,19.71 | 20.1,27.7 v20.1,29.29
  Top 0.254: U$5.10 19.2,12 v19.58,12.62 | U$5.24 v20.75,18.59 | U$5.39 v14.22,17.62 | U$4.1 20.1,27.7 U$4.PAD
  Top 0.61: U$13.6 23.39,37.66 arc73 v22.9,37.3 | C15.1 v38.2,15.9 | C16.1 v98.4,12.5
  Top 1.016: C11.2 v10.7,11.4 | C10.2 v11.1,23.7 | C12.2 v35,9.7
  other vias: 22.1,38.3 21.3,37.3 22.9,39.3 21.3,39.3 23.5,33.1 25,34.4 26.3,32.6 28,35.3 29.1,35.3 30,36.8 26.9,35.2 33.2,33 31.9,35.2 34.2,35.7 37.3,36 36,34 37.4,38.8 41,40.6 46.2,39.8 46.1,41.8 42.5,38.9 34.9,37.9 32.8,37.3 29.7,33 22.7,35.1 39.7,36.6 48.4,41.2 39.9,38.8 44.2,40.8 19.3,29.99 20.1,30.19 19.3,29.09 19.3,28.19 19.3,27.29 20.1,28.39 20.1,27.49 53.6,52.6 53.6,51.5 53.6,50.3 38.4,41.5 35.4,40.7 33,39.7 31.1,41.3 33.5,42.2 35.3,43.1 31.9,43.2 33.7,44 42.7,42
  pour Bottom: -20,-20 107.1,-20 107.1,84.9 -20,84.9
  pour Top (no thermals): 21.1,37.68 21.1,34.7 arc103 21.7,34 arc-42 22.8,33.7 arc24 24,30.7 arc80 25.2,30.6 28.1,32 30.3,32.6 31.9,32.7 34.7,31.2 35.2,30.9 36.8,30.9 36.8,33.2 40.4,36.5 43,38.5 46.7,39.1 49.23,38.95 arc90 50.2,39.9 49.9,40.9 48.6,41.5 48.3,42.3 37.2,42.6 34,44.8 30.6,43 30.7,37.7 25.92,37.66
  pour Top (no thermals): 53.3,53.5 55.2,53.2 55.2,50.6 53.4,49.5
N$2
  Top 0.2: C14.2 U$20.1
PH
  pour Top (no thermals): 24,40 24,40.6 arc-33 24.3,41.6 22.7,41.6 arc-143 22.7,42.2 23.5,42.3 25.6,47.4 arc-76 28.2,47.6 arc-15 31.3,49.5 arc-94 31.5,49.5 33.9,47.2 arc-88 33.9,46.8 31.6,44.6 arc80 27.5,44.2 arc53 25.8,40.8 25.8,40
PLL_1V8  (via drill 0.4)
  Top 0.2: U$5.21 22.18,17.15 arc58 22.8,17.5 arc-49 v23.4,18 | v25.3,19.6 arc39 C23.1
  Bottom 0.2: v23.4,18 v25.3,19.6
REXT
  Top 0.2: R3.1 20.2,22 arc-24 20.02,21.09 arc-49 19.7,20.8 arc55 19.3,20.4 U$5.27
SHIELD
  Bottom 0.406: 70.9,64.9 70.9,65.5 84.2,65.5 arc-90 84.5,65.2 84.5,44.5 80,44.5 arc-1 73.7,44.5 arc96 72.6,43.3 72.6,27.1 arc-90 72.2,26.7 57.6,26.7 arc96 56.7,25.7 56.7,18.5 | 70.9,64.9 arc-97 70,64.1 60.1,64.1 arc-44 59.1,64.5 arc137 55.2,62.7 arc-67 53.5,59.8 arc67 51.9,57.1 51.9,48 arc-98 51.1,47.3 39.8,47.3 arc-98 39.1,48 39.1,58.8 arc90 38.4,59.5 arc-95 37.5,60.4 37.5,65.1 arc90 37.1,65.5 4.6,65.5 arc140 4.1,64.5 arc-200 0.5,62.1 0.54,37.2 | 56.7,18.5 56.7,5.9 arc-49 56.2,4.8 arc62 55.4,2.3 | 55.4,2.3 arc59 56.7,0.9 arc159 58.8,4.8 arc100 55.7,4.2 arc40 55.4,2.3 | 55.4,2.3 arc-106 53.8,0.5 53,0.5 | 53,0.5 39.6,0.5 | 39.6,0.5 24,0.5 | 24,0.5 10.6,0.5 | 10.6,0.5 5.6,0.5 arc-107 4.5,2 arc28 4.6,3.6 | 4.6,3.6 arc113 1.3,5 arc-127 0.6,5.4 0.59,7.7 0.57,21.1 | 0.57,21.1 0.56,23.8 | 0.56,23.8 0.54,37.2 | 70.9,64.9 arc-90 71,64.8 71,64 arc90 71.5,63.5 U$14.1 | 24,0.5 U$16.SHIELD2 | U$12.SHIELD2 53,0.5 | U$12.SHIELD1 39.6,0.5 | U$9.SHIELD2 0.56,23.8 | U$9.SHIELD1 0.54,37.2 | U$8.SHIELD1 0.57,21.1 | U$8.SHIELD2 3.8,4.9 4,4.7 arc-33 4.6,3.6 | U$11.SHIELD 56.7,18.5 | U$16.SHIELD1 10.6,0.5
SHIELD-BR  (1 unrouted)
  Bottom 0.406: 94.8,3.6 arc182 99.5,3.5 99.5,13.8 arc90 98.3,15.2 97.49,15.2 | 94.8,3.6 arc-186 99.2,3.2 arc-76 96.4,0.5 78,0.5 arc-90 75.8,2.7 | 75.8,2.7 75.8,4.4 arc90 U$6.SHIELD1 U$10.SHIELD1 | U$10.SHIELD2 95.3,4.9 95.1,4.6 arc34 94.8,3.6 | U$6.SHIELD2 62.2,4.5 62.2,0.6 74.8,0.6 arc100 75.9,1.9 arc-5 75.8,2.7
VBUS1
  Top 0.254: U$4.8 17.7,28.7 17.1,28.8
  Top 0.61: 17.1,28.8 arc-49 16.5,29.2
  Top 1.016: 34.3,3 17.5,3 arc-95 13.8,6.4 arc-97 10.5,2.9 C21.+ | 34.3,3 39.6,3 arc94 42.7,6.2 arc-11 U$12.VBUS C12.1 | U$8.VBUS C10.1 | U$16.VBUS C11.1 | C1.+ 34.3,3
  Top 1.27: 7.5,10.3 arc9 8.6,9.3
  Top 1.422: U$9.VBUS 8.3,33.9 arc92 3,28.2 3,21.7 arc93 6.4,17.9 7.2,17.9 | U$8.VBUS 7.2,17.9 | 7.2,17.9 arc100 6.1,16.6 6.1,12.7 arc46 6.9,10.8 arc-1 7.5,10.3 | 8.6,9.3 arc33 9.4,9.1 10.8,9.1 arc-4 U$16.VBUS 13.8,6.4 | 15.1,28.7 arc-113 16.5,29.2
  Top 1.676: U$9.VBUS arc-58 10.8,33 arc50 16.5,29.2 | C17.+ 15.1,28.7
VBUS2  (via drill 0.4, 0.6)
  Top 0.254: U$4.9 17.7,28.2 arc37 17.1,27.8
  Top 0.61: 17.1,27.8 arc29 v16.7,27.2 | C15.2 U$11.VBUS1
  Top 1.676: v16.7,27.2 arc16 v17.1,26.2 | v48.1,25.4 v46.5,21 | C18.+ 51.1,21
  Top 1.93: U$14.7 75.6,60.9 arc-90 77.5,59.5 77.5,53.1 arc-63 72.3,48.4 arc65 69.9,46 69.9,31.6 arc-93 68,29.6 57.7,29.6 arc92 53.9,25.8 53.9,21 51.1,21 v46.5,21
  Bottom 0.2: v48.1,25.4 v47.4,25
  Bottom 1.676: v48.1,25.4 19.3,25.4 arc-30 17.8,25.8 v17.1,26.2 v16.7,27.2 | v46.5,21 45.1,19.9 U$11.VBUS2 U$11.VBUS1
VBUS2-BR  (via drill 0.6)  (3 unrouted)
  Top 0.2: 94.2,16.8 v93.78,16.22
  Top 0.305: 93.6,14.3 93.74,15.74
  Top 0.61: 93.8,16.4 v93.78,16.22 93.74,15.74 | v93.51,13.4 93.6,14.3 | C16.2 93.84,10.64 92.7,9.1
  Top 1.016: 92.7,9.1 arc-65 90.1,7.2
  Top 1.422: 94.2,16.8 arc6 93.8,16.4
  Top 1.676: 90.1,7.2 85.3,7.2 arc-90 U$10.VBUS | 92.7,9.1 arc22 v93.51,13.4 | U$15.7 94.2,16.8 | C20.+ 93.84,10.64
  Bottom 0.305: v93.51,13.4 v93.78,16.22
  Bottom 0.61: 93.74,15.74 93.8,16.2 | 93.6,14.3 93.5,13.7
  Bottom 1.422: 93.8,16.4 94.2,16.8
  Bottom 1.676: v93.51,13.4 93.5,13.3 | 94.2,16.8 U$15.7
VBUS-UP  (via drill 0.4)
  Top 0.2: U$5.41 13.78,16.65 v14.6,16.4 | U$14.2 73.3,61.8 arc-32 74.4,62.2 75.8,62.2 arc-86 78.8,59.7 78.9,53.1 arc-30 77.9,50.7 arc-44 72.8,47 arc73 71.4,45.2 71.4,31.1 arc-90 68.3,28 57.9,28 arc90 55.6,25.6 55.6,9.5 arc-90 54.7,8.6 52.9,8.6 arc90 50.5,6.2 50.5,3.9 arc-93 48.7,2 22.1,2 v21.4,1.9 | v15.8,14.9 arc49 17.1,14 18.5,13.8 arc-67 20.3,12.6 arc8 20.63,12.03 arc-37 20.9,10.4 arc-43 20.4,10 arc88 19.8,8.7 arc-3 v20.5,6.1
  Bottom 0.2: v14.6,16.4 v15.8,14.9 | v21.4,1.9 v20.5,6.1
VBUS-UP-BR
  Top 0.254: 85.9,17.6 arc-94 87.3,19.1 94.9,19.1 arc-80 96.18,18 arc-64 U$15.2
  Top 0.5: 85.9,17.6 arc-67 83,12.5 arc1 80.1,11 arc-30 68.4,8.3 arc104 65.9,5.3 arc-16 U$6.VBUS
VIN  (via drill 0.6)
  Top 0.2: v17.3,4.4 19,4.4 arc72 21.5,6.8 arc-63 23.6,8.7 arc-75 26.3,7.1 arc53 27.2,6.3 arc56 29,6.7
  Top 0.254: JP11.2 29,6.7 | v17.3,1.6 6.7,1.6 arc-81 5.8,2.4 5.8,3.3 arc90 2.8,6.6 arc-95 1.6,7.8 1.6,28.7 arc-78 6.4,34.8 arc6 8.9,35.3 arc-22 U$7.P$2
  Top 2.54: U$17.CENTER 15.4,41.3 arc-54 U$7.P$2
  Bottom 0.254: 28.2,42 v27.6,42.4 | v17.3,4.4 v17.3,1.6
  Bottom 2.54: C6.+ 22.8,44.7 arc41 28.2,42
  other vias: 28.6,42.1 27.1,41.5 28,41.4 22.2,45.4 21.2,45.1
  pour Top (no thermals): 24,39.2 24,38.7 25.9,38.7 arc23 27,38.8 arc-25 29.3,39.1 arc4 29.3,39.2 arc60 29.5,39.4 arc19 29.4,42.6 arc124 26.5,42 arc37 26.4,40.1 arc3 26.4,39.8 arc-93 25.8,39.3
  pour Top (no thermals): 13.3,45.6 20.1,47.5 arc-6 20.7,47.7 arc-103 22.5,46.4 arc4 22.8,45.6 arc-57 22,44.6 arc-1 21,44.5 arc24 17.3,44.2 16,41.8 14.7,41.4 arc-187
VSENSE
  Top 0.254: R2.1 R1.2 U$13.4
XIN
  Top 0.2: U$5.22 22.37,17.65 22.84,18.35 23.1,18.7 23.8,18.7 24.1,18.4 35.5,18.4 arc48 36.7,19.7 36.7,20.8 arc-97 37.5,21.7
XOUT
  Top 0.2: 22.16,18.15 22.54,18.75 22.8,19.1 24.1,19.1 24.4,18.8 35.2,18.8 arc79 36.2,20.1 arc2 36.2,20.9 36.2,21.1 arc90 35.6,21.7 U$20.2 C13.2